# EAGLE design W960 (EAGLE 6.6.0)
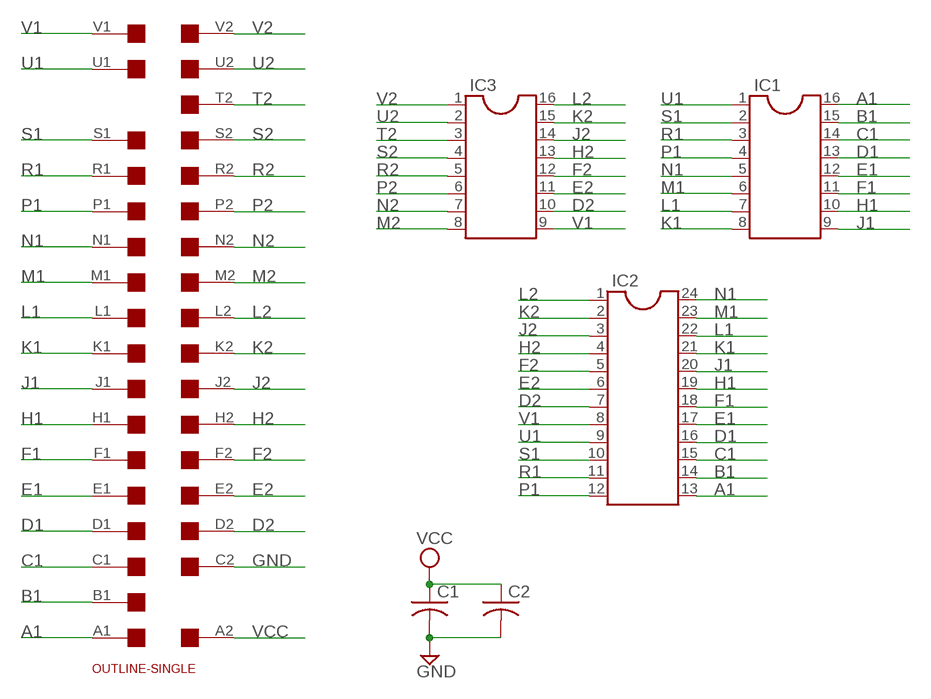
[diagram p0: schematic, sheet 1]

## Parts
C1  C-US050-025X075  [C050-025X075]
C2  C-US050-025X075  [C050-025X075]
IC1  DIL16  [DIL16]
IC2  DIL24-6  [DIL24-6]
IC3  DIL16  [DIL16]
U$1  EDGE-2CONNECTOR  [EDGE-CON2]
U$2  OUTLINE-SINGLE  [SINGLE]

## Nets
A1: IC1.16 IC2.13 U$1.A1
B1: IC1.15 IC2.14 U$1.B1
C1: IC1.14 IC2.15 U$1.C1
D1: IC1.13 IC2.16 U$1.D1
D2: IC2.7 IC3.10 U$1.D2
E1: IC1.12 IC2.17 U$1.E1
E2: IC2.6 IC3.11 U$1.E2
F1: IC1.11 IC2.18 U$1.F1
F2: IC2.5 IC3.12 U$1.F2
GND: C1.2 C2.2 U$1.C2
H1: IC1.10 IC2.19 U$1.H1
H2: IC2.4 IC3.13 U$1.H2
J1: IC1.9 IC2.20 U$1.J1
J2: IC2.3 IC3.14 U$1.J2
K1: IC1.8 IC2.21 U$1.K1
K2: IC2.2 IC3.15 U$1.K2
L1: IC1.7 IC2.22 U$1.L1
L2: IC2.1 IC3.16 U$1.L2
M1: IC1.6 IC2.23 U$1.M1
M2: IC3.8 U$1.M2
N1: IC1.5 IC2.24 U$1.N1
N2: IC3.7 U$1.N2
P1: IC1.4 IC2.12 U$1.P1
P2: IC3.6 U$1.P2
R1: IC1.3 IC2.11 U$1.R1
R2: IC3.5 U$1.R2
S1: IC1.2 IC2.10 U$1.S1
S2: IC3.4 U$1.S2
T2: IC3.3 U$1.T2
U1: IC1.1 IC2.9 U$1.U1
U2: IC3.2 U$1.U2
V1: IC2.8 IC3.9 U$1.V1
V2: IC3.1 U$1.V2
VCC: C1.1 C2.1 U$1.A2
Unconnected: U$1.B2 U$1.T1

## Library data of the parts
C1 C2 = rcl:C-US: CAPACITOR, American symbol
IC1 IC3 = ic-package:DIL16: Dual In Line / Socket
IC2 = ic-package:DIL24: Dual In Line
U$1 = dec-con:EDGE-2: Double-Sided DEC edge connector.
U$2 = dec-con:OUTLINE-*: Board outlines for DEC boards.

## Board
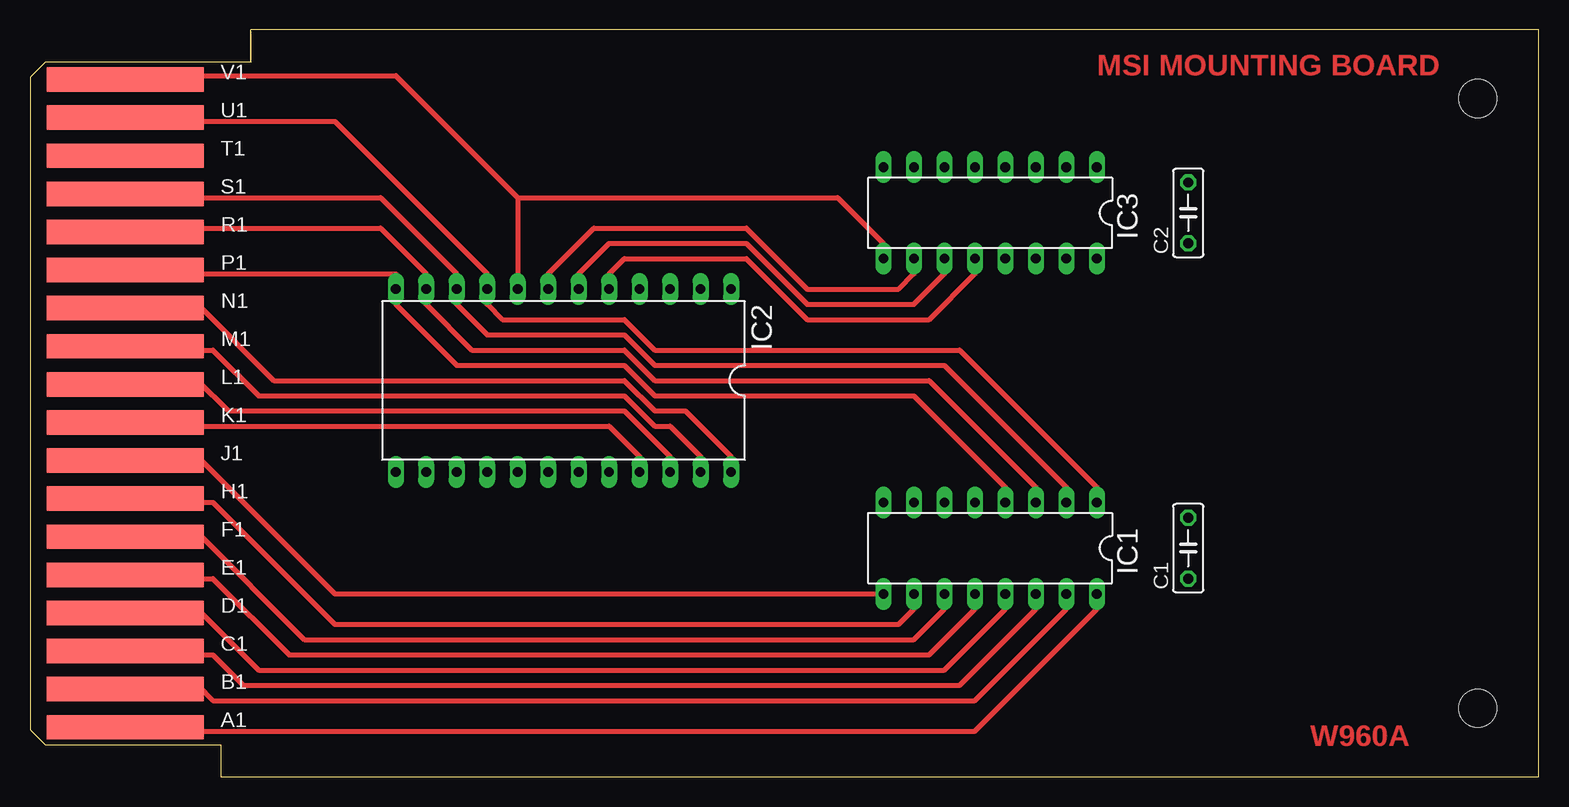
[diagram p1: board, top side]
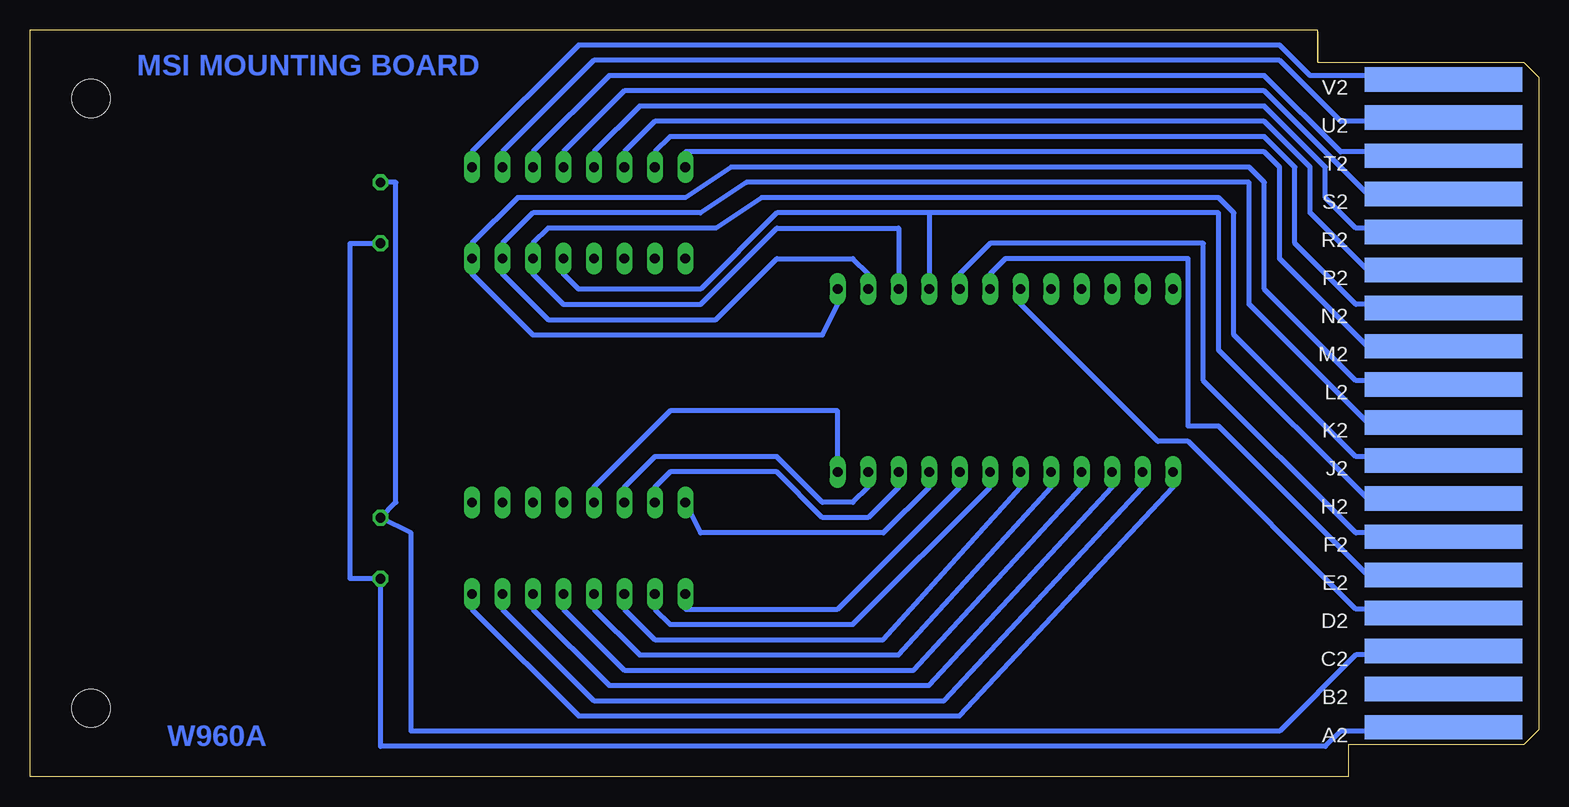
[diagram p2: board, bottom side, seen from below]

Size 125.73 x 62.23 mm. Coordinates in mm from the lower left corner, seen from the top.
Copper layers (1+16): Top 0.035mm / dielectric 1.5mm / Bottom 0.035mm
Design rules "16mils": minimum track width 16mil, minimum drill 32mil, track to track 15mil, track to pad 10mil, pad to pad 10mil, via to via 10mil, smd to smd 10mil, copper to edge 13mil, drill to drill 10mil, minimum pad ring 10mil, minimum via ring 8mil, stop-mask expansion 0mil, vias tented up to drill 0mil, thermal gap 10mil

### Footprints (pad centres in the part's own frame; a part is rotated, then mirrored left to right if it is on the bottom)
C050-025X075 = drill 0.813 octagon: 1 -2.54,0; 2 2.54,0
DIL16 = drill 0.813 long: 1 -8.89,-3.81; 2 -6.35,-3.81; 3 -3.81,-3.81; 4 -1.27,-3.81; 5 1.27,-3.81; 6 3.81,-3.81; 7 6.35,-3.81; 8 8.89,-3.81; 9 8.89,3.81; 10 6.35,3.81; 11 3.81,3.81; 12 1.27,3.81; 13 -1.27,3.81; 14 -3.81,3.81; 15 -6.35,3.81; 16 -8.89,3.81
DIL24-6 = drill 0.813 long: 1 -13.97,-7.62; 2 -11.43,-7.62; 3 -8.89,-7.62; 4 -6.35,-7.62; 5 -3.81,-7.62; 6 -1.27,-7.62; 7 1.27,-7.62; 8 3.81,-7.62; 9 6.35,-7.62; 10 8.89,-7.62; 11 11.43,-7.62; 12 13.97,-7.62; 13 13.97,7.62; 14 11.43,7.62; 15 8.89,7.62; 16 6.35,7.62; 17 3.81,7.62; 18 1.27,7.62; 19 -1.27,7.62; 20 -3.81,7.62; 21 -6.35,7.62; 22 -8.89,7.62; 23 -11.43,7.62; 24 -13.97,7.62
EDGE-CON2 = smd 13.106 x 2.032: A1 7.938,4.128; B1 7.938,7.303; C1 7.938,10.477; D1 7.938,13.652; E1 7.938,16.828; F1 7.938,20.003; H1 7.938,23.177; J1 7.938,26.352; K1 7.938,29.527; L1 7.938,32.703; M1 7.938,35.877; N1 7.938,39.053; P1 7.938,42.227; R1 7.938,45.403; S1 7.938,48.578; T1 7.938,51.752; U1 7.938,54.928; V1 7.938,58.102 | smd 13.106 x 2.032 bottom: A2 7.938,4.128; B2 7.938,7.303; C2 7.938,10.477; D2 7.938,13.652; E2 7.938,16.828; F2 7.938,20.003; H2 7.938,23.177; J2 7.938,26.352; K2 7.938,29.527; L2 7.938,32.703; M2 7.938,35.877; N2 7.938,39.053; P2 7.938,42.227; R2 7.938,45.403; S2 7.938,48.578; T2 7.938,51.752; U2 7.938,54.928; V2 7.938,58.102
SINGLE = hole 3.175: 120.65,56.515; 120.65,5.715

### Placement (x,y rotation side)
C1  96.52,19.05 90 top
C2  96.52,46.99 90 top
IC1  80.01,19.05 180 top
IC2  44.45,33.02 180 top
IC3  80.01,46.99 180 top
U$1  0,0 0 top
U$2  0,0 0 top

### Tracks (layer width: path | path; a pad name or v marks a point on that pad's centre or on a via)
A1
  Top 0.406: IC1.16 88.9,13.97 78.74,3.81 13.97,3.81 U$1.A1
  Bottom 0.406: IC2.13 30.48,24.13 48.26,5.08 80.01,5.08 88.9,13.97 IC1.16
B1
  Top 0.406: IC1.15 86.36,13.97 78.74,6.35 15.24,6.35 13.97,7.62 U$1.B1
  Bottom 0.406: IC2.14 33.02,24.13 49.53,6.35 78.74,6.35 86.36,13.97 IC1.15
C1
  Top 0.406: IC1.14 83.82,13.97 77.47,7.62 17.78,7.62 15.24,10.16 13.97,10.16 U$1.C1
  Bottom 0.406: IC2.15 35.56,24.13 50.8,7.62 77.47,7.62 83.82,13.97 IC1.14
D1
  Top 0.406: IC1.13 81.28,13.97 76.2,8.89 19.05,8.89 13.97,13.97 U$1.D1
  Bottom 0.406: IC2.16 38.1,24.13 52.07,8.89 76.2,8.89 81.28,13.97 IC1.13
D2
  Top 0.406: IC3.10 73.66,41.91 72.39,40.64 64.77,40.64 59.69,45.72 46.99,45.72 43.18,41.91 IC2.7
  Bottom 0.406: IC2.7 43.18,39.37 31.75,27.94 29.21,27.94 15.24,13.97 13.97,13.97 U$1.D2
E1
  Top 0.406: IC1.12 78.74,13.97 74.93,10.16 21.59,10.16 15.24,16.51 13.97,16.51 U$1.E1
  Bottom 0.406: IC1.12 78.74,13.97 74.93,10.16 53.34,10.16 40.64,24.13 IC2.17
E2
  Top 0.406: IC3.11 76.2,41.91 73.66,39.37 64.77,39.37 59.69,44.45 48.26,44.45 45.72,41.91 IC2.6
  Bottom 0.406: IC2.6 45.72,41.91 44.45,43.18 29.21,43.18 29.21,29.21 26.67,29.21 13.97,16.51 12.7,16.51 U$1.E2
F1
  Top 0.406: IC1.11 76.2,13.97 73.66,11.43 22.86,11.43 13.97,20.32 12.7,20.32 U$1.F1
  Bottom 0.406: IC2.18 43.18,24.13 54.61,11.43 73.66,11.43 76.2,13.97 IC1.11
F2
  Top 0.406: IC2.5 48.26,41.91 49.53,43.18 59.69,43.18 64.77,38.1 74.93,38.1 78.74,41.91 IC3.12
  Bottom 0.406: IC2.5 48.26,41.91 45.72,44.45 27.94,44.45 27.94,33.02 15.24,20.32 13.97,20.32 U$1.F2
GND
  Bottom 0.406: C2.2 95.25,49.53 95.25,22.86 C1.2 93.98,20.32 93.98,3.81 21.59,3.81 15.24,10.16 13.97,10.16 U$1.C2
H1
  Top 0.406: IC1.10 73.66,13.97 72.39,12.7 25.4,12.7 15.24,22.86 13.97,22.86 U$1.H1
  Bottom 0.406: IC1.10 73.66,13.97 72.39,12.7 57.15,12.7 45.72,24.13 IC2.19
H2
  Bottom 0.406: 50.8,46.99 63.5,46.99 69.85,40.64 80.01,40.64 81.28,41.91 IC3.13 | 50.8,46.99 IC2.4 | 50.8,46.99 26.67,46.99 26.67,35.56 13.97,22.86 12.7,22.86 U$1.H2
J1
  Top 0.406: IC1.9 25.4,15.24 13.97,26.67 12.7,26.67 U$1.J1
  Bottom 0.406: IC2.20 48.26,24.13 58.42,13.97 71.12,13.97 IC1.9
J2
  Bottom 0.406: IC2.3 53.34,45.72 63.5,45.72 69.85,39.37 81.28,39.37 83.82,41.91 IC3.14 83.82,44.45 82.55,45.72 68.58,45.72 64.77,48.26 26.67,48.26 25.4,46.99 25.4,36.83 15.24,26.67 13.97,26.67 U$1.J2
K1
  Top 0.406: IC2.21 50.8,26.67 48.26,29.21 13.97,29.21 U$1.K1
  Bottom 0.406: IC1.8 69.85,20.32 54.61,20.32 50.8,24.13 IC2.21
K2
  Bottom 0.406: IC2.2 55.88,41.91 57.15,43.18 63.5,43.18 68.58,38.1 82.55,38.1 86.36,41.91 IC3.15 86.36,44.45 83.82,46.99 69.85,46.99 66.04,49.53 24.13,49.53 24.13,39.37 13.97,29.21 12.7,29.21 U$1.K2
L1
  Top 0.406: IC2.22 53.34,26.67 49.53,30.48 16.51,30.48 13.97,33.02 12.7,33.02 U$1.L1
  Bottom 0.406: IC1.7 73.66,24.13 72.39,25.4 63.5,25.4 59.69,21.59 55.88,21.59 53.34,24.13 IC2.22
L2
  Bottom 0.406: IC2.1 58.42,39.37 59.69,36.83 83.82,36.83 88.9,41.91 IC3.16 88.9,44.45 85.09,48.26 71.12,48.26 67.31,50.8 24.13,50.8 22.86,49.53 22.86,40.64 15.24,33.02 13.97,33.02 U$1.L2
M1
  Top 0.406: IC2.23 55.88,26.67 53.34,29.21 52.07,29.21 49.53,31.75 19.05,31.75 15.24,35.56 13.97,35.56 U$1.M1
  Bottom 0.406: IC1.6 76.2,24.13 73.66,26.67 63.5,26.67 59.69,22.86 57.15,22.86 55.88,24.13 IC2.23
M2
  Bottom 0.406: IC3.8 71.12,52.07 22.86,52.07 21.59,50.8 21.59,43.18 13.97,35.56 12.7,35.56 U$1.M2
N1
  Top 0.406: IC2.24 58.42,26.67 54.61,30.48 52.07,30.48 49.53,33.02 20.32,33.02 13.97,39.37 U$1.N1
  Bottom 0.406: IC1.5 78.74,24.13 72.39,30.48 58.42,30.48 IC2.24
N2
  Bottom 0.406: IC3.7 73.66,52.07 72.39,53.34 22.86,53.34 20.32,50.8 20.32,44.45 15.24,39.37 13.97,39.37 U$1.N2
P1
  Top 0.406: U$1.P1 13.97,41.91 30.48,41.91 IC2.12 30.48,39.37 35.56,34.29 49.53,34.29 52.07,31.75 73.66,31.75 81.28,24.13 IC1.4
P2
  Bottom 0.406: IC3.6 76.2,52.07 73.66,54.61 22.86,54.61 19.05,50.8 19.05,46.99 13.97,41.91 12.7,41.91 U$1.P2
R1
  Top 0.406: U$1.R1 12.7,45.72 29.21,45.72 33.02,41.91 IC2.11 33.02,39.37 36.83,35.56 49.53,35.56 52.07,33.02 74.93,33.02 83.82,24.13 IC1.3
R2
  Bottom 0.406: IC3.5 78.74,52.07 74.93,55.88 22.86,55.88 17.78,50.8 17.78,48.26 15.24,45.72 13.97,45.72 U$1.R2
S1
  Top 0.406: U$1.S1 13.97,48.26 29.21,48.26 35.56,41.91 IC2.10 35.56,39.37 38.1,36.83 49.53,36.83 52.07,34.29 76.2,34.29 86.36,24.13 IC1.2
S2
  Bottom 0.406: IC3.4 81.28,52.07 76.2,57.15 22.86,57.15 13.97,48.26 12.7,48.26 U$1.S2
T2
  Bottom 0.406: IC3.3 83.82,52.07 77.47,58.42 22.86,58.42 16.51,52.07 13.97,52.07 U$1.T2
U1
  Top 0.406: U$1.U1 13.97,54.61 25.4,54.61 38.1,41.91 IC2.9 38.1,39.37 39.37,38.1 49.53,38.1 52.07,35.56 77.47,35.56 88.9,24.13 IC1.1
U2
  Bottom 0.406: IC3.2 86.36,52.07 78.74,59.69 21.59,59.69 16.51,54.61 12.7,54.61 U$1.U2
V1
  Top 0.406: 40.64,48.26 67.31,48.26 71.12,44.45 IC3.9 | U$1.V1 12.7,58.42 30.48,58.42 40.64,48.26 | 40.64,48.26 IC2.8
V2
  Bottom 0.406: IC3.1 88.9,52.07 80.01,60.96 21.59,60.96 19.05,58.42 13.97,58.42 U$1.V2
VCC
  Bottom 0.406: C2.1 99.06,44.45 99.06,16.51 C1.1 96.52,2.54 17.78,2.54 16.51,3.81 13.97,3.81 U$1.A2

### Text on the board
Top: MSI MOUNTING BOARD | W960A
Bottom: MSI MOUNTING BOARD | W960A
tValues: M2 | N2 | P2 | R2 | S2 | T2 | U2 | V2 | P1 | R1 | S1 | U1 | V1 | D2 | E2 | F2 | H2 | J2 | K2 | L2 | V1 | D2 | E2 | F2 | H2 | J2 | K2 | L2 | K1 | L1 | M1 | N1 | P1 | R1 | S1 | U1 | A1 | B1 | C1 | D1 | E1 | F1 | H1 | J1 | K1 | L1 | M1 | N1 | J1 | H1 | F1 | E1 | D1 | C1 | B1 | A1